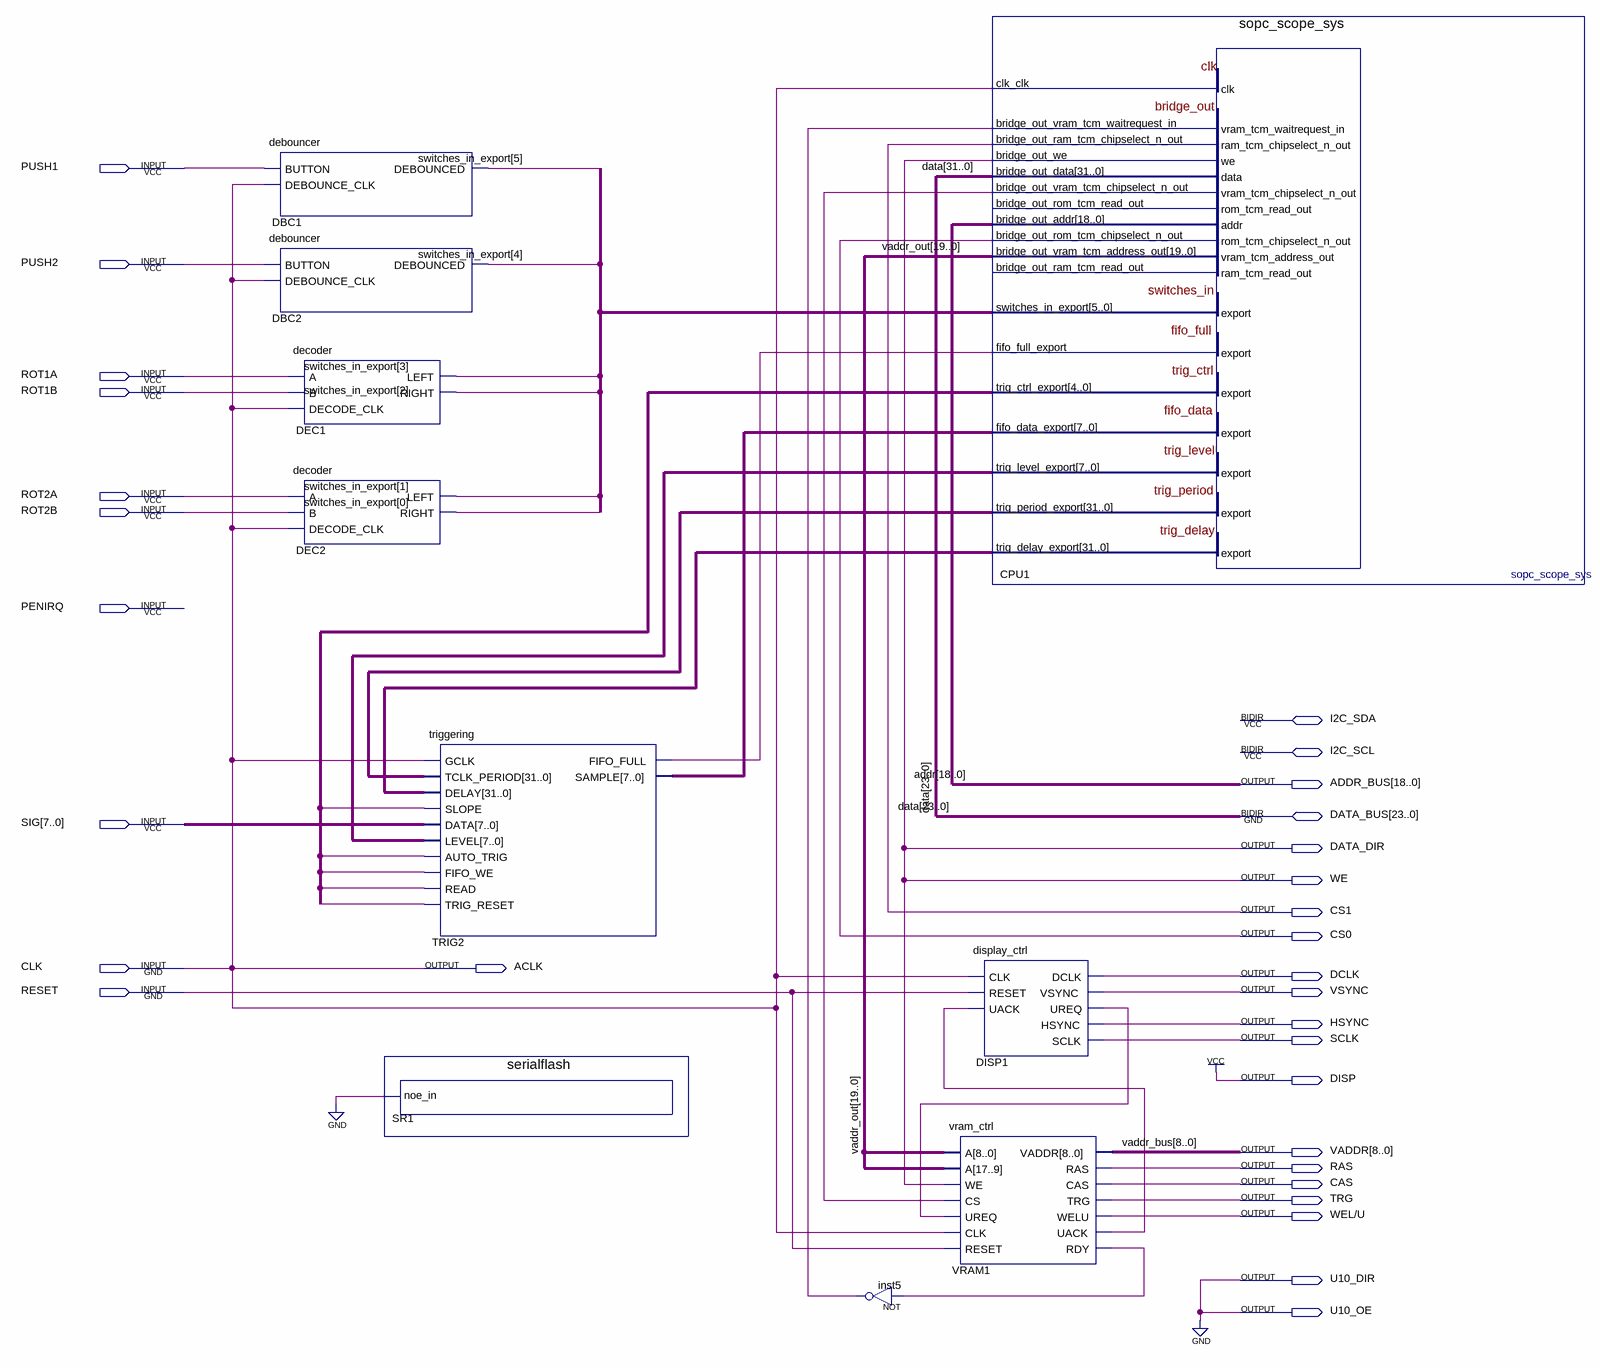
[diagram p0: schematic sheet]
// Quartus schematic sopc_scope.bdf as structural Verilog: 10 symbols, 31 pins
module sopc_scope (
  input  PUSH1,
  input  PUSH2,
  input  ROT1A,
  input  ROT1B,
  input  ROT2A,
  input  ROT2B,
  input  PENIRQ,
  input  [7:0] SIG,
  input  CLK,
  input  RESET,
  inout  I2C_SDA,
  inout  I2C_SCL,
  inout  [23:0] DATA_BUS,
  output [18:0] ADDR_BUS,
  output DATA_DIR,
  output WE,
  output CS1,
  output CS0,
  output ACLK,
  output DCLK,
  output VSYNC,
  output HSYNC,
  output SCLK,
  output DISP,
  output [8:0] VADDR,
  output RAS,
  output CAS,
  output TRG,
  output \WEL/U ,
  output U10_DIR,
  output U10_OE
);

  wire CPU1_bridge_out_vram_tcm_chipselect_n_out, DISP1_ureq, inst5_out, TRIG2_fifo_full, VRAM1_rdy,
       VRAM1_uack;
  wire [4:0] trig_ctrl;
  wire [5:0] switches_in_export;
  wire [7:0] CPU1_trig_level_export, TRIG2_sample;
  wire [19:0] vaddr_out;
  wire [31:0] CPU1_trig_delay_export, CPU1_trig_period_export;
  wire [31:24] data;

  debouncer DBC1 (.BUTTON(PUSH1), .DEBOUNCE_CLK(CLK), .DEBOUNCED(switches_in_export[5]));
  debouncer DBC2 (.BUTTON(PUSH2), .DEBOUNCE_CLK(CLK), .DEBOUNCED(switches_in_export[4]));
  decoder DEC1 (.A(ROT1A), .B(ROT1B), .DECODE_CLK(CLK), .LEFT(switches_in_export[3]), .RIGHT(switches_in_export[2]));
  decoder DEC2 (.A(ROT2A), .B(ROT2B), .DECODE_CLK(CLK), .LEFT(switches_in_export[1]), .RIGHT(switches_in_export[0]));
  triggering TRIG2 (
    .GCLK(CLK), .TCLK_PERIOD(CPU1_trig_period_export), .DELAY(CPU1_trig_delay_export), .SLOPE(trig_ctrl[1]),
    .DATA(SIG), .LEVEL(CPU1_trig_level_export), .AUTO_TRIG(trig_ctrl[0]), .FIFO_WE(trig_ctrl[2]),
    .READ(trig_ctrl[3]), .TRIG_RESET(trig_ctrl[4]), .FIFO_FULL(TRIG2_fifo_full), .SAMPLE(TRIG2_sample));
  serialflash SR1 (.noe_in(1'b0));
  not inst5 (inst5_out, VRAM1_rdy);
  sopc_scope_sys CPU1 (
    .clk_clk(CLK), .bridge_out_vram_tcm_waitrequest_in(inst5_out), .switches_in_export(switches_in_export),
    .fifo_full_export(TRIG2_fifo_full), .fifo_data_export(TRIG2_sample),
    .bridge_out_ram_tcm_chipselect_n_out(CS1), .bridge_out_we(DATA_DIR),
    .bridge_out_vram_tcm_chipselect_n_out(CPU1_bridge_out_vram_tcm_chipselect_n_out),
    .bridge_out_addr(ADDR_BUS), .bridge_out_rom_tcm_chipselect_n_out(CS0),
    .bridge_out_vram_tcm_address_out(vaddr_out), .trig_ctrl_export(trig_ctrl),
    .trig_level_export(CPU1_trig_level_export), .trig_period_export(CPU1_trig_period_export),
    .trig_delay_export(CPU1_trig_delay_export), .bridge_out_data({data, DATA_BUS}));  // open: bridge_out_rom_tcm_read_out, bridge_out_ram_tcm_read_out
  display_ctrl DISP1 (
    .CLK(CLK), .RESET(RESET), .UACK(VRAM1_uack), .DCLK(DCLK), .VSYNC(VSYNC), .UREQ(DISP1_ureq),
    .HSYNC(HSYNC), .SCLK(SCLK));
  vram_ctrl VRAM1 (
    .A(vaddr_out[19:2]), .WE(DATA_DIR), .CS(CPU1_bridge_out_vram_tcm_chipselect_n_out), .UREQ(DISP1_ureq),
    .CLK(CLK), .RESET(RESET), .VADDR(VADDR), .RAS(RAS), .CAS(CAS), .TRG(TRG), .WELU(\WEL/U ),
    .UACK(VRAM1_uack), .RDY(VRAM1_rdy));

  assign ACLK = CLK;
  assign DISP = 1'b1;
  assign U10_DIR = 1'b0;
  assign U10_OE = 1'b0;
  assign WE = DATA_DIR;

  // Other names for the same wires on the sheet: addr[18:0] = ADDR_BUS; data[23:0] = DATA_BUS; vaddr_bus[8:0] = VADDR
endmodule
